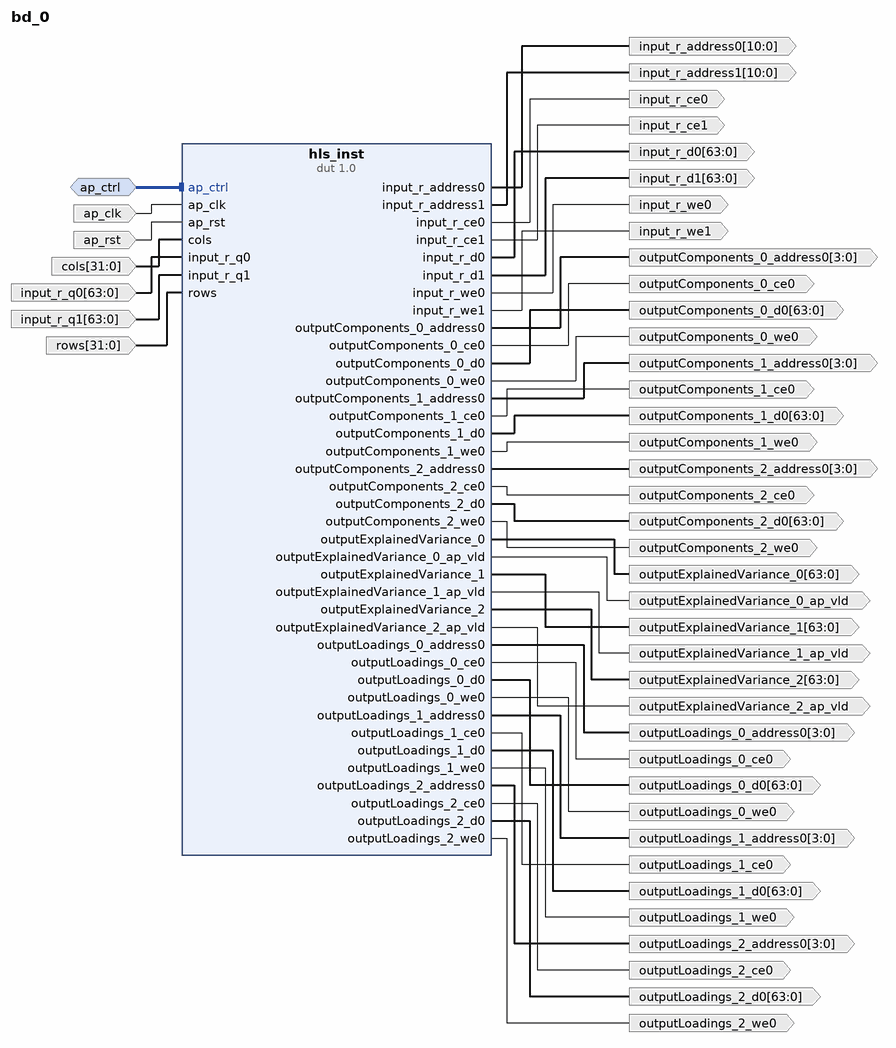
[diagram p0: block diagram of the top level]
# Vivado block design bd_0, xcu250-figd2104-2L-e, Vivado 2023.2
create_bd_design bd_0

create_bd_intf_port -mode Slave -vlnv xilinx.com:interface:acc_handshake_rtl:1.0 ap_ctrl
create_bd_port -dir I -type clk ap_clk
set_property -dict {CONFIG.FREQ_HZ 300000000.0} [get_bd_ports ap_clk]
create_bd_port -dir I -type rst ap_rst
set_property -dict {CONFIG.POLARITY ACTIVE_HIGH} [get_bd_ports ap_rst]
create_bd_port -dir I -from 31 -to 0 -type data cols
create_bd_port -dir O -from 10 -to 0 -type data input_r_address0
create_bd_port -dir O -from 10 -to 0 -type data input_r_address1
create_bd_port -dir O input_r_ce0
create_bd_port -dir O input_r_ce1
create_bd_port -dir O -from 63 -to 0 -type data input_r_d0
create_bd_port -dir O -from 63 -to 0 -type data input_r_d1
create_bd_port -dir I -from 63 -to 0 -type data input_r_q0
create_bd_port -dir I -from 63 -to 0 -type data input_r_q1
create_bd_port -dir O input_r_we0
create_bd_port -dir O input_r_we1
create_bd_port -dir O -from 3 -to 0 -type data outputComponents_0_address0
create_bd_port -dir O outputComponents_0_ce0
create_bd_port -dir O -from 63 -to 0 -type data outputComponents_0_d0
create_bd_port -dir O outputComponents_0_we0
create_bd_port -dir O -from 3 -to 0 -type data outputComponents_1_address0
create_bd_port -dir O outputComponents_1_ce0
create_bd_port -dir O -from 63 -to 0 -type data outputComponents_1_d0
create_bd_port -dir O outputComponents_1_we0
create_bd_port -dir O -from 3 -to 0 -type data outputComponents_2_address0
create_bd_port -dir O outputComponents_2_ce0
create_bd_port -dir O -from 63 -to 0 -type data outputComponents_2_d0
create_bd_port -dir O outputComponents_2_we0
create_bd_port -dir O -from 63 -to 0 -type data outputExplainedVariance_0
create_bd_port -dir O outputExplainedVariance_0_ap_vld
create_bd_port -dir O -from 63 -to 0 -type data outputExplainedVariance_1
create_bd_port -dir O outputExplainedVariance_1_ap_vld
create_bd_port -dir O -from 63 -to 0 -type data outputExplainedVariance_2
create_bd_port -dir O outputExplainedVariance_2_ap_vld
create_bd_port -dir O -from 3 -to 0 -type data outputLoadings_0_address0
create_bd_port -dir O outputLoadings_0_ce0
create_bd_port -dir O -from 63 -to 0 -type data outputLoadings_0_d0
create_bd_port -dir O outputLoadings_0_we0
create_bd_port -dir O -from 3 -to 0 -type data outputLoadings_1_address0
create_bd_port -dir O outputLoadings_1_ce0
create_bd_port -dir O -from 63 -to 0 -type data outputLoadings_1_d0
create_bd_port -dir O outputLoadings_1_we0
create_bd_port -dir O -from 3 -to 0 -type data outputLoadings_2_address0
create_bd_port -dir O outputLoadings_2_ce0
create_bd_port -dir O -from 63 -to 0 -type data outputLoadings_2_d0
create_bd_port -dir O outputLoadings_2_we0
create_bd_port -dir I -from 31 -to 0 -type data rows

create_bd_cell -type ip -vlnv xilinx.com:hls:dut:1.0 hls_inst

# ---- connections ----

connect_bd_intf_net -intf_net ap_ctrl_0_1 [get_bd_intf_ports ap_ctrl] [get_bd_intf_pins hls_inst/ap_ctrl]
connect_bd_net -net ap_clk_0_1 [get_bd_ports ap_clk] [get_bd_pins hls_inst/ap_clk]
connect_bd_net -net ap_rst_0_1 [get_bd_ports ap_rst] [get_bd_pins hls_inst/ap_rst]
connect_bd_net -net cols_0_1 [get_bd_ports cols] [get_bd_pins hls_inst/cols]
connect_bd_net [get_bd_pins hls_inst/input_r_address0] [get_bd_ports input_r_address0]
connect_bd_net [get_bd_pins hls_inst/input_r_address1] [get_bd_ports input_r_address1]
connect_bd_net [get_bd_pins hls_inst/input_r_ce0] [get_bd_ports input_r_ce0]
connect_bd_net [get_bd_pins hls_inst/input_r_ce1] [get_bd_ports input_r_ce1]
connect_bd_net [get_bd_pins hls_inst/input_r_d0] [get_bd_ports input_r_d0]
connect_bd_net [get_bd_pins hls_inst/input_r_d1] [get_bd_ports input_r_d1]
connect_bd_net [get_bd_pins hls_inst/input_r_we0] [get_bd_ports input_r_we0]
connect_bd_net [get_bd_pins hls_inst/input_r_we1] [get_bd_ports input_r_we1]
connect_bd_net [get_bd_pins hls_inst/outputComponents_0_address0] [get_bd_ports outputComponents_0_address0]
connect_bd_net [get_bd_pins hls_inst/outputComponents_0_ce0] [get_bd_ports outputComponents_0_ce0]
connect_bd_net [get_bd_pins hls_inst/outputComponents_0_d0] [get_bd_ports outputComponents_0_d0]
connect_bd_net [get_bd_pins hls_inst/outputComponents_0_we0] [get_bd_ports outputComponents_0_we0]
connect_bd_net [get_bd_pins hls_inst/outputComponents_1_address0] [get_bd_ports outputComponents_1_address0]
connect_bd_net [get_bd_pins hls_inst/outputComponents_1_ce0] [get_bd_ports outputComponents_1_ce0]
connect_bd_net [get_bd_pins hls_inst/outputComponents_1_d0] [get_bd_ports outputComponents_1_d0]
connect_bd_net [get_bd_pins hls_inst/outputComponents_1_we0] [get_bd_ports outputComponents_1_we0]
connect_bd_net [get_bd_pins hls_inst/outputComponents_2_address0] [get_bd_ports outputComponents_2_address0]
connect_bd_net [get_bd_pins hls_inst/outputComponents_2_ce0] [get_bd_ports outputComponents_2_ce0]
connect_bd_net [get_bd_pins hls_inst/outputComponents_2_d0] [get_bd_ports outputComponents_2_d0]
connect_bd_net [get_bd_pins hls_inst/outputComponents_2_we0] [get_bd_ports outputComponents_2_we0]
connect_bd_net [get_bd_pins hls_inst/outputExplainedVariance_0] [get_bd_ports outputExplainedVariance_0]
connect_bd_net [get_bd_pins hls_inst/outputExplainedVariance_0_ap_vld] [get_bd_ports outputExplainedVariance_0_ap_vld]
connect_bd_net [get_bd_pins hls_inst/outputExplainedVariance_1] [get_bd_ports outputExplainedVariance_1]
connect_bd_net [get_bd_pins hls_inst/outputExplainedVariance_1_ap_vld] [get_bd_ports outputExplainedVariance_1_ap_vld]
connect_bd_net [get_bd_pins hls_inst/outputExplainedVariance_2] [get_bd_ports outputExplainedVariance_2]
connect_bd_net [get_bd_pins hls_inst/outputExplainedVariance_2_ap_vld] [get_bd_ports outputExplainedVariance_2_ap_vld]
connect_bd_net [get_bd_pins hls_inst/outputLoadings_0_address0] [get_bd_ports outputLoadings_0_address0]
connect_bd_net [get_bd_pins hls_inst/outputLoadings_0_ce0] [get_bd_ports outputLoadings_0_ce0]
connect_bd_net [get_bd_pins hls_inst/outputLoadings_0_d0] [get_bd_ports outputLoadings_0_d0]
connect_bd_net [get_bd_pins hls_inst/outputLoadings_0_we0] [get_bd_ports outputLoadings_0_we0]
connect_bd_net [get_bd_pins hls_inst/outputLoadings_1_address0] [get_bd_ports outputLoadings_1_address0]
connect_bd_net [get_bd_pins hls_inst/outputLoadings_1_ce0] [get_bd_ports outputLoadings_1_ce0]
connect_bd_net [get_bd_pins hls_inst/outputLoadings_1_d0] [get_bd_ports outputLoadings_1_d0]
connect_bd_net [get_bd_pins hls_inst/outputLoadings_1_we0] [get_bd_ports outputLoadings_1_we0]
connect_bd_net [get_bd_pins hls_inst/outputLoadings_2_address0] [get_bd_ports outputLoadings_2_address0]
connect_bd_net [get_bd_pins hls_inst/outputLoadings_2_ce0] [get_bd_ports outputLoadings_2_ce0]
connect_bd_net [get_bd_pins hls_inst/outputLoadings_2_d0] [get_bd_ports outputLoadings_2_d0]
connect_bd_net [get_bd_pins hls_inst/outputLoadings_2_we0] [get_bd_ports outputLoadings_2_we0]
connect_bd_net -net input_r_q0_0_1 [get_bd_ports input_r_q0] [get_bd_pins hls_inst/input_r_q0]
connect_bd_net -net input_r_q1_0_1 [get_bd_ports input_r_q1] [get_bd_pins hls_inst/input_r_q1]
connect_bd_net -net rows_0_1 [get_bd_ports rows] [get_bd_pins hls_inst/rows]

validate_bd_design
save_bd_design
